# Altium schematic sheet ETA1090SheetV2.SchDoc
size A4
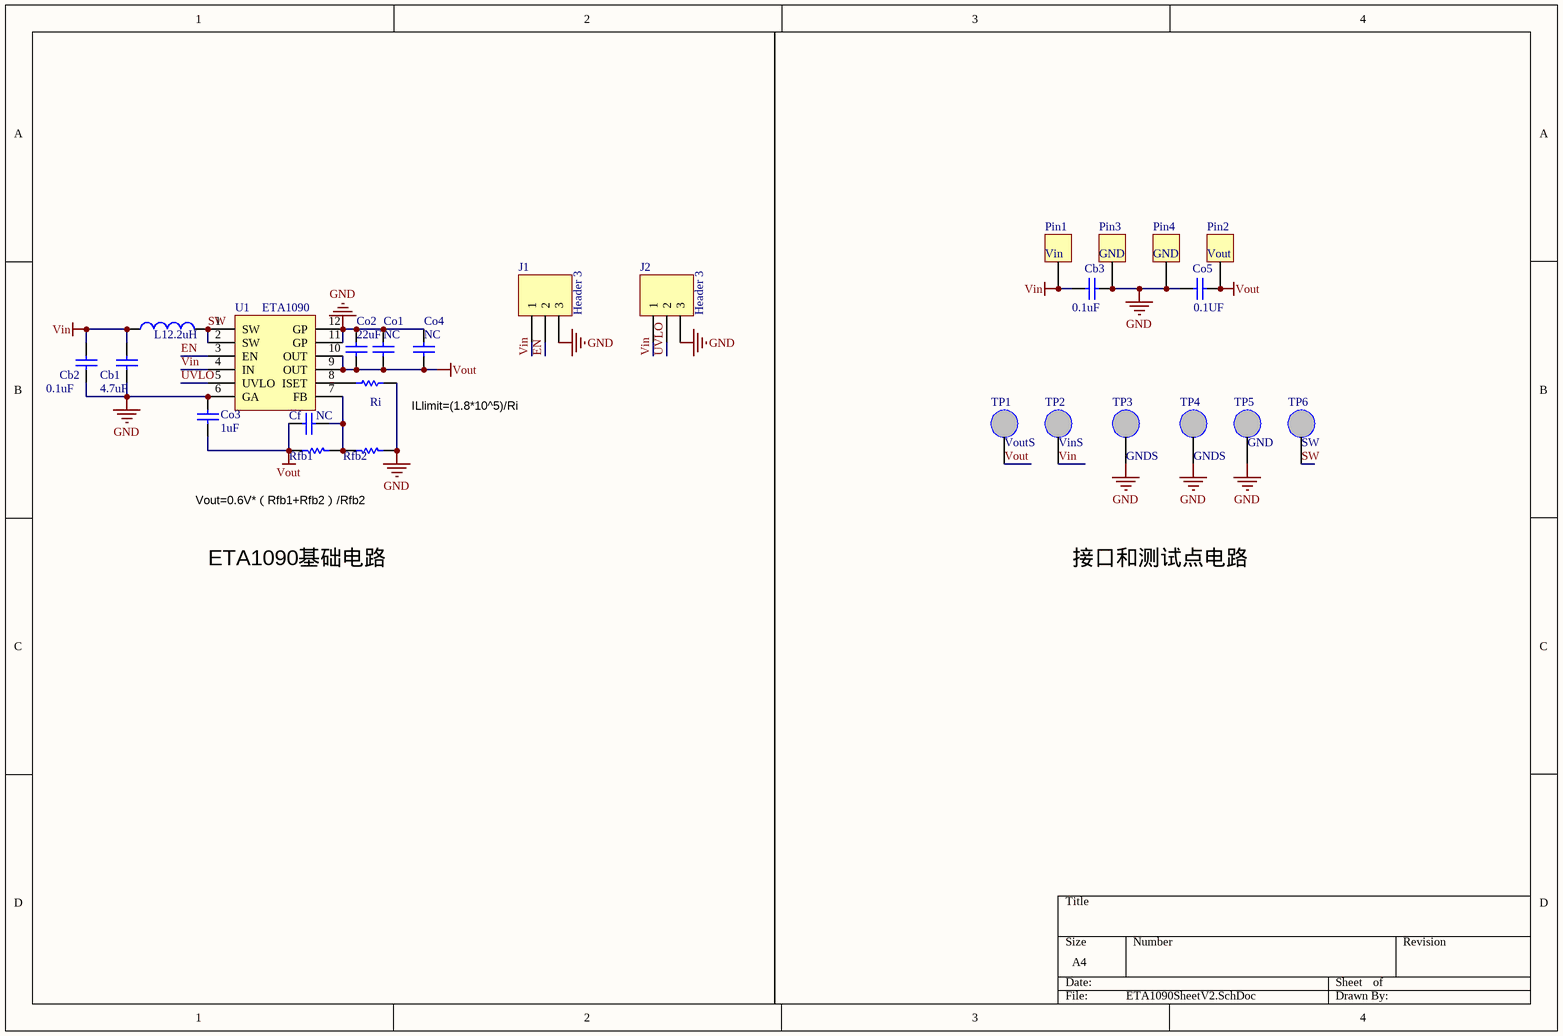
[diagram p0: ETA1090SheetV2.SchDoc]

## Parts
Cb1  value 4.7uF  [C0805]  (hidden comment: Cap)
Cb2  value 0.1uF  [C0603]  (hidden comment: Cap)
Cb3  value 0.1uF  [C0603]  (hidden comment: Cap)
Cf  value NC  [C0603]  (hidden comment: Cap Semi)
Co1  value NC  [C0805]  (hidden comment: Cap)
Co2  22uF  [C0805]
Co3  1uF  [C0603]
Co4  NC  [C0603]
Co5  0.1UF  [C0603]
J1  Header 3  [HDR1X3]
J2  Header 3  [HDR1X3]
L1  value 2.2uH  [L_8X8]  (hidden comment: Inductor)
Pin1  Vin  [PIN3]
Pin2  Vout  [PIN3]
Pin3  GND  [PIN3]
Pin4  GND  [PIN3]
Rfb1  Res1  [r0603]  (value not drawn)
Rfb2  Res1  [r0603]  (value not drawn)
Ri  Res1  [r0603]  (value not drawn)
TP1  VoutS  [PIN0.8]
TP2  VinS  [PIN0.8]
TP3  GNDS  [PIN0.8]
TP4  GNDS  [PIN0.8]
TP5  GND  [PIN0.8]
TP6  SW  [PIN0.8]
U1  ETA1090  [DFN33_12]

## Nets
GND: Cb1.1 Cb2.1 Cb3.1 Co1.2 Co2.2 Co3.2 Co4.2 Co5.2 J1.3 J2.3 Pin3.0 Pin4.0 Rfb2.1 Ri.1 TP3.1 TP4.1 TP5.1 U1.6(GA) U1.11(GP) U1.12(GP)
Vin: Cb1.2 Cb2.2 Cb3.2 J1.1 J2.1 L1.2 Pin1.0 TP2.1 U1.4(IN)
Vout: Cf.2 Co1.1 Co2.1 Co3.1 Co4.1 Co5.1 Pin2.0 Rfb1.2 TP1.1 U1.9(OUT) U1.10(OUT)
EN: J1.2 U1.3(EN)
SW: L1.1 TP6.1 U1.1(SW) U1.2(SW)
UVLO: J2.2 U1.5(UVLO)
NetCf_1: Cf.1 Rfb1.1 Rfb2.2 U1.7(FB)
NetRi_2: Ri.2 U1.8(ISET)

## Notes on the sheet
- ILlimit=(1.8*10^5)/Ri
- Vout=0.6V*（Rfb1+Rfb2）/Rfb2
- ETA1090基础电路
- 接口和测试点电路

## Library data of the parts
Cb1-Cb3 Co1-Co5 = Cap: Capacitor; Published: 8-Jun-2000; LatestRevisionDate: 17-Jul-2002; LatestRevisionNote: Re-released for DXP Platform.; PackageReference: RAD-0.3; Publisher: Altium Limited
Cf = Cap Semi: Capacitor (Semiconductor SIM Model); Published: 8-Jun-2000; LatestRevisionDate: 17-Jul-2002; LatestRevisionNote: Re-released for DXP Platform.; PackageReference: C1206; Publisher: Altium Limited
J1 J2 = Header 3: Header, 3-Pin; LatestRevisionDate: 17-Jul-2002; LatestRevisionNote: Re-released for DXP Platform.; Publisher: Altium Limited
L1 = Inductor: Code_IEC: 1005; Published: 8-Jun-2000; LatestRevisionDate: 17-Jul-2002; LatestRevisionNote: Re-released for DXP Platform.; PackageReference: 0402-A; Publisher: Altium Limited; Code_JEITA: 0402
Pin1-Pin4 = TP1
Rfb1 Rfb2 Ri = Res1: Resistor; Value: 1K; Published: 8-Jun-2000; LatestRevisionDate: 17-Jul-2002; LatestRevisionNote: Re-released for DXP Platform.; PackageReference: AXIAL-0.3; Publisher: Altium Limited
TP1-TP6 = TP2
U1 = Header 6X2H: Header, 6-Pin, Dual row, Right Angle; LatestRevisionDate: 17-Jul-2002; LatestRevisionNote: Re-released for DXP Platform.; Publisher: Altium Limited